# EAGLE design Cyclone_Keychain_SSOP28 (EAGLE 7.7.0)
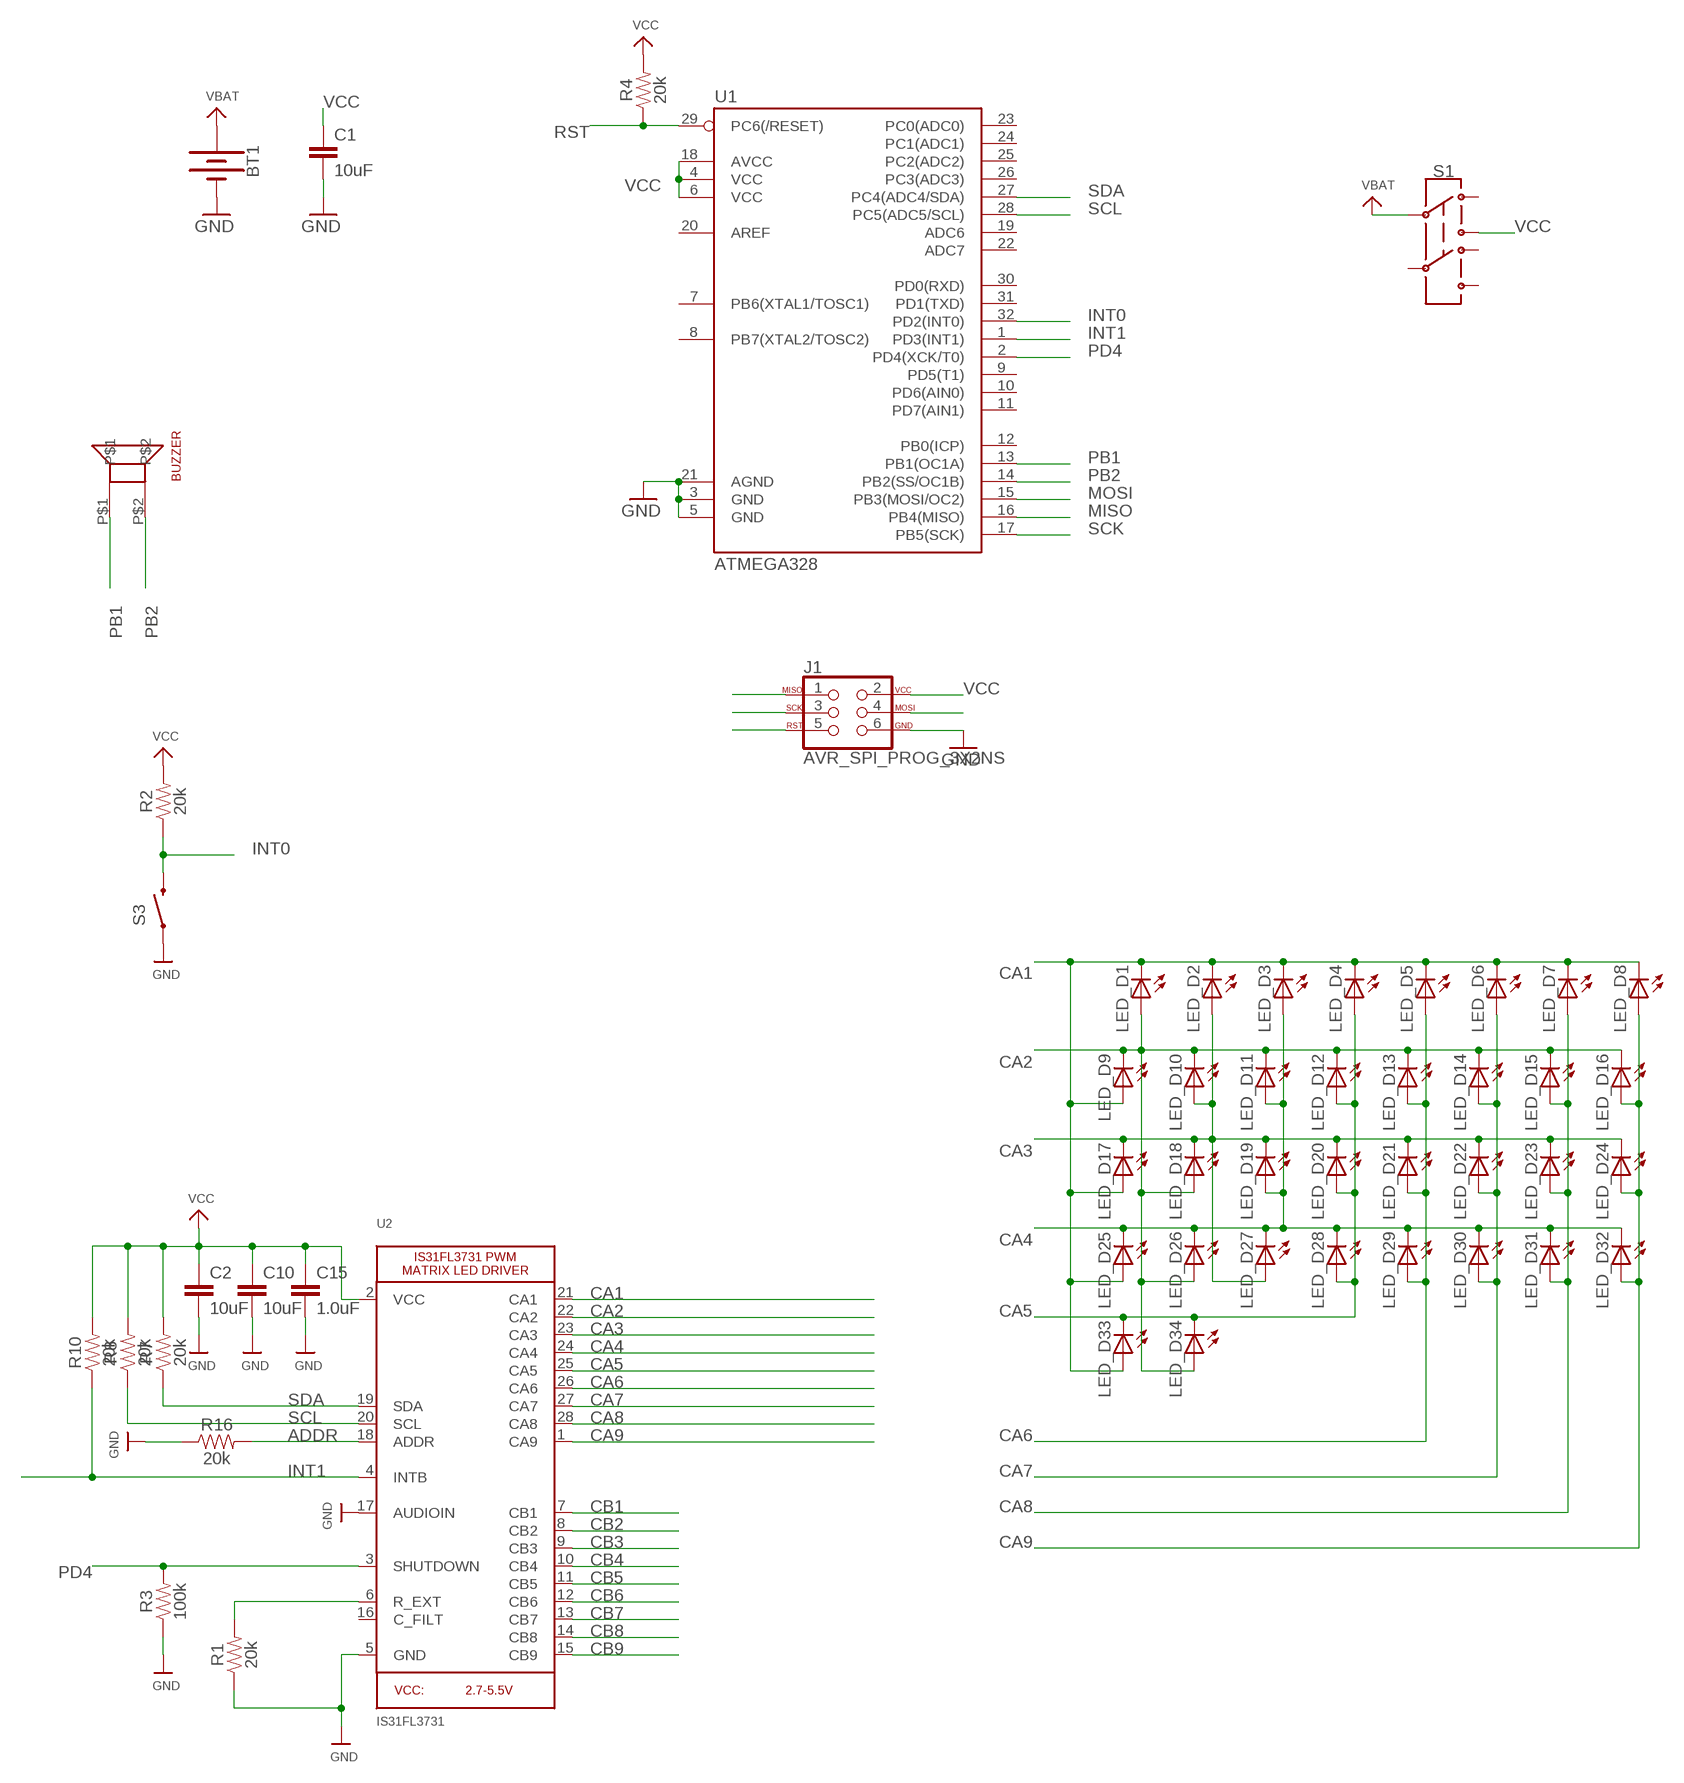
[diagram p0: schematic, sheet 1]

## Parts
BT1  BATTERY-20MM_PTH_WIDEPOS  [BATTCOM_20MM_PTH_WIDEPOS]
C1  10uF  10UF-0805-10V-10%  [0805]
C2  10uF  10UF-0805-10V-10%  [0805]
C10  10uF  10UF-0805-10V-10%  [0805]
C15  1.0uF  1.0UF-0805-25V-10%  [0805]
J1  AVR_SPI_PROG_3X2NS  [2X3-NS]
LED_D1  LEDCHIP-LED0805  [CHIP-LED0805]
LED_D2  LEDCHIP-LED0805  [CHIP-LED0805]
LED_D3  LEDCHIP-LED0805  [CHIP-LED0805]
LED_D4  LEDCHIP-LED0805  [CHIP-LED0805]
LED_D5  LEDCHIP-LED0805  [CHIP-LED0805]
LED_D6  LEDCHIP-LED0805  [CHIP-LED0805]
LED_D7  LEDCHIP-LED0805  [CHIP-LED0805]
LED_D8  LEDCHIP-LED0805  [CHIP-LED0805]
LED_D9  LEDCHIP-LED0805  [CHIP-LED0805]
LED_D10  LEDCHIP-LED0805  [CHIP-LED0805]
LED_D11  LEDCHIP-LED0805  [CHIP-LED0805]
LED_D12  LEDCHIP-LED0805  [CHIP-LED0805]
LED_D13  LEDCHIP-LED0805  [CHIP-LED0805]
LED_D14  LEDCHIP-LED0805  [CHIP-LED0805]
LED_D15  LEDCHIP-LED0805  [CHIP-LED0805]
LED_D16  LEDCHIP-LED0805  [CHIP-LED0805]
LED_D17  LEDCHIP-LED0805  [CHIP-LED0805]
LED_D18  LEDCHIP-LED0805  [CHIP-LED0805]
LED_D19  LEDCHIP-LED0805  [CHIP-LED0805]
LED_D20  LEDCHIP-LED0805  [CHIP-LED0805]
LED_D21  LEDCHIP-LED0805  [CHIP-LED0805]
LED_D22  LEDCHIP-LED0805  [CHIP-LED0805]
LED_D23  LEDCHIP-LED0805  [CHIP-LED0805]
LED_D24  LEDCHIP-LED0805  [CHIP-LED0805]
LED_D25  LEDCHIP-LED0805  [CHIP-LED0805]
LED_D26  LEDCHIP-LED0805  [CHIP-LED0805]
LED_D27  LEDCHIP-LED0805  [CHIP-LED0805]
LED_D28  LEDCHIP-LED0805  [CHIP-LED0805]
LED_D29  LEDCHIP-LED0805  [CHIP-LED0805]
LED_D30  LEDCHIP-LED0805  [CHIP-LED0805]
LED_D31  LEDCHIP-LED0805  [CHIP-LED0805]
LED_D32  LEDCHIP-LED0805  [CHIP-LED0805]
LED_D33  LEDCHIP-LED0805  [CHIP-LED0805]
LED_D34  LEDCHIP-LED0805  [CHIP-LED0805]
R1  20k  20KOHM-0805-1/8W-5%  [0805]
R2  20k  20KOHM-0805-1/8W-5%  [0805]
R3  100k  20KOHM-0805-1/8W-5%  [0805]
R4  20k  20KOHM-0805-1/8W-5%  [0805]
R7  20k  20KOHM-0805-1/8W-5%  [0805]
R8  20k  20KOHM-0805-1/8W-5%  [0805]
R10  20k  20KOHM-0805-1/8W-5%  [0805]
R16  20k  20KOHM-0805-1/8W-5%  [0805]
S1  SWITCH-DPDT-SMD-AYZ0202  [SWITCH_DPDT_SMD_AYZ0202]
S3  SWITCH-MOMENTARY-2SMD  [TACTILE_SWITCH_SMD]
U1  ATMEGA328  ATMEGA328P_TQFP  [TQFP32-08]
U2  IS31FL3731  IS31FL3731SSOP  [SSOP28DB]
U$11  PIEZO_BUZZER_SMT  [PIEZO_BUZZER_SMT]

## Nets
ADDR: R16.2 U2.18(ADDR)
CA1: LED_D1.C LED_D2.C LED_D3.C LED_D4.C LED_D5.C LED_D6.C LED_D7.C LED_D8.C LED_D9.A LED_D17.A LED_D25.A LED_D33.A U2.21(CA1)
CA2: LED_D1.A LED_D9.C LED_D10.C LED_D11.C LED_D12.C LED_D13.C LED_D14.C LED_D15.C LED_D16.C LED_D18.A LED_D26.A LED_D34.A U2.22(CA2)
CA3: LED_D2.A LED_D10.A LED_D17.C LED_D18.C LED_D19.C LED_D20.C LED_D21.C LED_D22.C LED_D23.C LED_D24.C LED_D27.A U2.23(CA3)
CA4: LED_D3.A LED_D11.A LED_D19.A LED_D25.C LED_D26.C LED_D27.C LED_D28.C LED_D29.C LED_D30.C LED_D31.C LED_D32.C U2.24(CA4)
CA5: LED_D4.A LED_D12.A LED_D20.A LED_D28.A LED_D33.C LED_D34.C U2.25(CA5)
CA6: LED_D5.A LED_D13.A LED_D21.A LED_D29.A U2.26(CA6)
CA7: LED_D6.A LED_D14.A LED_D22.A LED_D30.A U2.27(CA7)
CA8: LED_D7.A LED_D15.A LED_D23.A LED_D31.A U2.28(CA8)
CA9: LED_D8.A LED_D16.A LED_D24.A LED_D32.A U2.1(CA9)
CB1: U2.7(CB1)
CB2: U2.8(CB2)
CB3: U2.9(CB3)
CB4: U2.10(CB4)
CB5: U2.11(CB5)
CB6: U2.12(CB6)
CB7: U2.13(CB7)
CB8: U2.14(CB8)
CB9: U2.15(CB9)
GND: BT1.2(-) C1.2 C2.2 C10.2 C15.2 J1.6 R1.1 R3.1 R16.1 S3.1 U1.3(GND) U1.5(GND) U1.21(AGND) U2.5(GND) U2.17(AUDIOIN)
INT0: R2.1 S3.3 U1.32(PD2(INT0))
INT1: R10.1 U1.1(PD3(INT1)) U2.4(INTB)
MISO: J1.1 U1.16(PB4(MISO))
MOSI: J1.4 U1.15(PB3(MOSI/OC2))
PB1: U1.13(PB1(OC1A)) U$11.P$1
PB2: U1.14(PB2(SS/OC1B)) U$11.P$2
PD4: R3.2 U1.2(PD4(XCK/T0)) U2.3(SHUTDOWN)
R_EXT: R1.2 U2.6(R_EXT)
RST: J1.5 R4.1 U1.29(PC6(/RESET))
SCK: J1.3 U1.17(PB5(SCK))
SCL: R8.1 U1.28(PC5(ADC5/SCL)) U2.20(SCL)
SDA: R7.1 U1.27(PC4(ADC4/SDA)) U2.19(SDA)
VBAT: BT1.1(+) S1.2
VCC: C1.1 C2.1 C10.1 C15.1 J1.2 R2.2 R4.2 R7.2 R8.2 R10.2 S1.3 U1.4(VCC) U1.6(VCC) U1.18(AVCC) U2.2(VCC)
Unconnected: S1.1 S1.4 S1.5 S1.6 U1.7(PB6(XTAL1/TOSC1)) U1.8(PB7(XTAL2/TOSC2)) U1.9(PD5(T1)) U1.10(PD6(AIN0)) U1.11(PD7(AIN1)) U1.12(PB0(ICP)) U1.19(ADC6) U1.20(AREF) U1.22(ADC7) U1.23(PC0(ADC0)) U1.24(PC1(ADC1)) U1.25(PC2(ADC2)) U1.26(PC3(ADC3)) U1.30(PD0(RXD)) U1.31(PD1(TXD)) U2.16(C_FILT)

## Library data of the parts
BT1 = SparkFun-Batteries:BATTERY: Battery - Single Cell A variety of battery chemistries, sizes, and footprints. Device List: 20MM_PTH - Coin Cell Battery Holder - 20mm (PTH) <https://www.sparkfun.com/products/783> 12MM_SMD - Coin Cell Battery Holder - 12mm (SMD) <https://www.sparkfun.com/products/10592> 12MM_PTH - Coin Cell Battery Holder - 12mm (PTH) <https://www.sparkfun.com/products/7948> 20MM_SMD - 20mm Coin Cell Battery Holder (SMD) (2 legs) Used on the Big Time Watch Kit <https://www.sparkfun.com/products/11734> 20MM_SMD_4LEGS - Coin Cell Battery Holder - 20mm (SMD) <https://www.sparkfun.com/products/11892> 20MM_SMD_4LEGS_OVERPASTE - Coin Cell Battery Holder - 20mm (SMD) <https://www.sparkfun.com/products/11892> (Over-paste on the legs) 24.5MM_PTH - Coin Cell Battery Holder - 24.5mm (PTH) <https://www.sparkfun.com/products/8863> 9V - 9V Battery Holder - PC Mount Used on the SparkFun SparkPunk Sound Kit <https://www.sparkfun.com/products/11177> and SparkFun SparkPunk Sequencer Kit <https://www.sparkfun.com/products/12707> 18650 - Battery Holder - 18650 (PTH) <https://www.sparkfun.com/products/13113> AA - Battery Holder - 1xAA (PTH) <https://www.sparkfun.com/products/7949> AAA - Battery Holder - 1xAAA (PTH) <https://www.sparkfun.com/products/12718> AA_KIT - Battery Holder - 1xAA (PTH) <https://www.sparkfun.com/products/7949> Special kit package - pads only have exposed copper on one side of the board. AAA_KIT - Battery Holder - 1xAAA (PTH) <https://www.sparkfun.com/products/12718> Special kit package - pads only have exposed copper on one side of the board.
C1 C2 C10 = SparkFun-Capacitors:10UF: 10.0µF ceramic capacitors A capacitor is a passive two-terminal electrical component used to store electrical energy temporarily in an electric field.; PROD_ID: CAP-11330
C15 = SparkFun-Capacitors:1.0UF: 1µF ceramic capacitors A capacitor is a passive two-terminal electrical component used to store electrical energy temporarily in an electric field.; PROD_ID: CAP-08064
J1 = SparkFun-Connectors:AVR_SPI_PROG_3X2: AVR ISP 6 Pin This is the reduced ISP connector for AVR programming. Common on Arduino. This footprint will take up less PCB space and can be used with a 10-pin to 6-pin adapter such as SKU: BOB-08508 **Special note about "TEST_POINT" package. The stop mask is on the top side, so if you want your programming test points to be on the bottom of your board, make sure to place this package on the bottom side of the board. This also ensure that the orientation to program from the bottom side will be correct. SparkFun Products: SparkFun ISP Pogo Adapter <https://www.sparkfun.com/products/11591> - NS Tiny AVR Programmer <https://www.sparkfun.com/products/11801> -PTH
LED_D1-LED_D34 = led:LED: LED OSRAM: - CHIPLED LG R971, LG N971, LY N971, LG Q971, LY Q971, LO R971, LY R971 LH N974, LH R974 LS Q976, LO Q976, LY Q976 LO Q996 - Hyper CHIPLED LW Q18S LB Q993, LB Q99A, LB R99A - SideLED LS A670, LO A670, LY A670, LG A670, LP A670 LB A673, LV A673, LT A673, LW A673 LH A674 LY A675 LS A676, LA A676, LO A676, LY A676, LW A676 LS A679, LY A679, LG A679 - Hyper Micro SIDELED® LS Y876, LA Y876, LO Y876, LY Y876 LT Y87S - SmartLED LW L88C, LW L88S LB L89C, LB L89S, LG L890 LS L89K, LO L89K, LY L89K LS L896, LA L896, LO L896, LY L896 - TOPLED LS T670, LO T670, LY T670, LG T670, LP T670 LSG T670, LSP T670, LSY T670, LOP T670, LYG T670 LG T671, LOG T671, LSG T671 LB T673, LV T673, LT T673, LW T673 LH T674 LS T676, LA T676, LO T676, LY T676, LB T676, LH T676, LSB T676, LW T676 LB T67C, LV T67C, LT T67C, LS T67K, LO T67K, LY T67K, LW E67C LS E67B, LA E67B, LO E67B, LY E67B, LB E67C, LV E67C, LT E67C LW T67C LS T679, LY T679, LG T679 LS T770, LO T770, LY T770, LG T770, LP T770 LB T773, LV T773, LT T773, LW T773 LH T774 LS E675, LA E675, LY E675, LS T675 LS T776, LA T776, LO T776, LY T776, LB T776 LHGB T686 LT T68C, LB T68C - Hyper Mini TOPLED® LB M676 - Mini TOPLED Santana® LG M470 LS M47K, LO M47K, LY M47K Source: http://www.osram.convergy.de LUXEON: - LUMILED® LXK2-PW12-R00, LXK2-PW12-S00, LXK2-PW14-U00, LXK2-PW14-V00 LXK2-PM12-R00, LXK2-PM12-S00, LXK2-PM14-U00 LXK2-PE12-Q00, LXK2-PE12-R00, LXK2-PE12-S00, LXK2-PE14-T00, LXK2-PE14-U00 LXK2-PB12-K00, LXK2-PB12-L00, LXK2-PB12-M00, LXK2-PB14-N00, LXK2-PB14-P00, LXK2-PB14-Q00 LXK2-PR12-L00, LXK2-PR12-M00, LXK2-PR14-Q00, LXK2-PR14-R00 LXK2-PD12-Q00, LXK2-PD12-R00, LXK2-PD12-S00 LXK2-PH12-R00, LXK2-PH12-S00 LXK2-PL12-P00, LXK2-PL12-Q00, LXK2-PL12-R00 Source: www.luxeon.com KINGBRIGHT: KA-3528ASYC Source: www.kingbright.com
R1 R2 R4 R7 R8 R10 R16 = SparkFun-Resistors:20KOHM: 20kΩ resistor A resistor is a passive two-terminal electrical component that implements electrical resistance as a circuit element. Resistors act to reduce current flow, and, at the same time, act to lower voltage levels within circuits. - Wikipedia
R3 = SparkFun-Resistors:20KOHM: 20kΩ resistor A resistor is a passive two-terminal electrical component that implements electrical resistance as a circuit element. Resistors act to reduce current flow, and, at the same time, act to lower voltage levels within circuits. - Wikipedia; VALUE: 20k
S1 = !CustomParts:SWITCH-DPDT: Double-Pole, Double-Throw (DPDT) Switch Double-pole, double-throw switches. Variant Overview PTH-GPI-152-3013 Used on SparkFun Geiger Counter <https://www.sparkfun.com/products/11345> SMD-AY0202 Surface Mount DPDT Switch <https://www.sparkfun.com/products/597> (COM-00597) Used on e.g. LilyPad Arduino USB - ATmega32U4 Board <https://www.sparkfun.com/products/12049>; PROD_ID: SWCH-08179; SF_SKU: COM-00597
S3 = SparkFun:SWITCH-MOMENTARY-2
U1 = SparkFun-IC-Microcontroller:ATMEGA328P_TQFP: Popular 328P in QFP Storefront component: ATmega328 - TQFP <https://www.sparkfun.com/products/13448> (COM-13448) Datasheet <http://www.sparkfun.com/datasheets/Components/SMD/ATMega328.pdf> SparkFun Products SparkFun RedBoard - Programmed with Arduino <https://www.sparkfun.com/products/12757> (DEV-12757) Arduino Pro Mini 328 - 5V/16MHz <https://www.sparkfun.com/products/11113> (DEV-11113) Arduino Pro Mini 328 - 3.3V/8MHz <https://www.sparkfun.com/products/11114> (DEV-11114) SparkFun OpenLog <https://www.sparkfun.com/products/13712> (DEV-13712) SparkFun MicroView - OLED Arduino Module <https://www.sparkfun.com/products/12923> (DEV-12923) SparkFun Digital Sandbox <https://www.sparkfun.com/products/12651> (DEV-12651) SparkFun PicoBoard <https://www.sparkfun.com/products/11888> (WIG-11888) Arduino Fio <https://www.sparkfun.com/products/10116> (DEV-10116) LilyPad Arduino 328 Main Board <https://www.sparkfun.com/products/13342> (DEV-13342) SparkFun RedStick <https://www.sparkfun.com/products/13741> (DEV-13741) LilyPad MP3 <https://www.sparkfun.com/products/11013> (DEV-11013) LilyPad Arduino SimpleSnap <https://www.sparkfun.com/products/10941> (DEV-10941) SparkFun Stepoko <https://www.sparkfun.com/products/13899> (ROB-13899) SparkFun Geiger Counter <https://www.sparkfun.com/products/11345> (SEN-11345) SparkFun EL Sequencer <https://www.sparkfun.com/products/12781> (COM-12781) Arduino Pro 328 - 5V/16MHz <https://www.sparkfun.com/products/10915> (DEV-10915) CryptoCape <https://www.sparkfun.com/products/12773> (DEV-12773) SparkFun IR Thermometer Evaluation Board - MLX90614 <https://www.sparkfun.com/products/10740> (SEN-10740) SparkFun RedBot Mainboard <https://www.sparkfun.com/products/12097> (ROB-12097) Arduino Pro 328 - 3.3V/8MHz <https://www.sparkfun.com/products/10914> (DEV-10914) SparkFun Block for Intel® Edison - Arduino <https://www.sparkfun.com/products/13036> (DEV-13036) SparkFun Simon Says - Surface Mount Soldering Kit <https://www.sparkfun.com/products/10935> (KIT-10935) SparkFun 7-Segment Serial Display - Red <https://www.sparkfun.com/products/11441> (COM-11441) SparkFun 7-Segment Serial Display - White <https://www.sparkfun.com/products/11629> (COM-11629) SparkFun 7-Segment Serial Display - Yellow <https://www.sparkfun.com/products/11443> (COM-11443) SparkFun 7-Segment Serial Display - Kelly Green <https://www.sparkfun.com/products/11440> (COM-11440) SparkFun 7-Segment Serial Display - Blue <https://www.sparkfun.com/products/11442> (COM-11442) SparkFun OpenSegment Serial Display - 20mm (Blue) <https://www.sparkfun.com/products/11647> (COM-11647) SparkFun OpenSegment Serial Display - 20mm (Green) <https://www.sparkfun.com/products/11646> (COM-11646) SparkFun OpenSegment Serial Display - 20mm (White) <https://www.sparkfun.com/products/11648> (COM-11648) SparkFun OpenSegment Serial Display - 20mm (Red) <https://www.sparkfun.com/products/11644> (COM-11644) SparkFun OpenSegment Serial Display - 20mm (Yellow) <https://www.sparkfun.com/products/11645> (COM-11645) SparkFun OpenSegment Shield <https://www.sparkfun.com/products/13190> (DEV-13190); PROD_ID: IC-09069; VALUE: ATMEGA328P_TQFP
U2 = !CustomParts:IS31FL3731: IS31FL3731 PWM LED Matrix Driver
U$11 = !CustomParts:PIEZO_BUZZER_SMT: CUI Inc. CPT-9019S-SMT

## Net classes
2 LEDPower: width 0.203 mm
3 ButtonSignal: width 0.203 mm

## Board
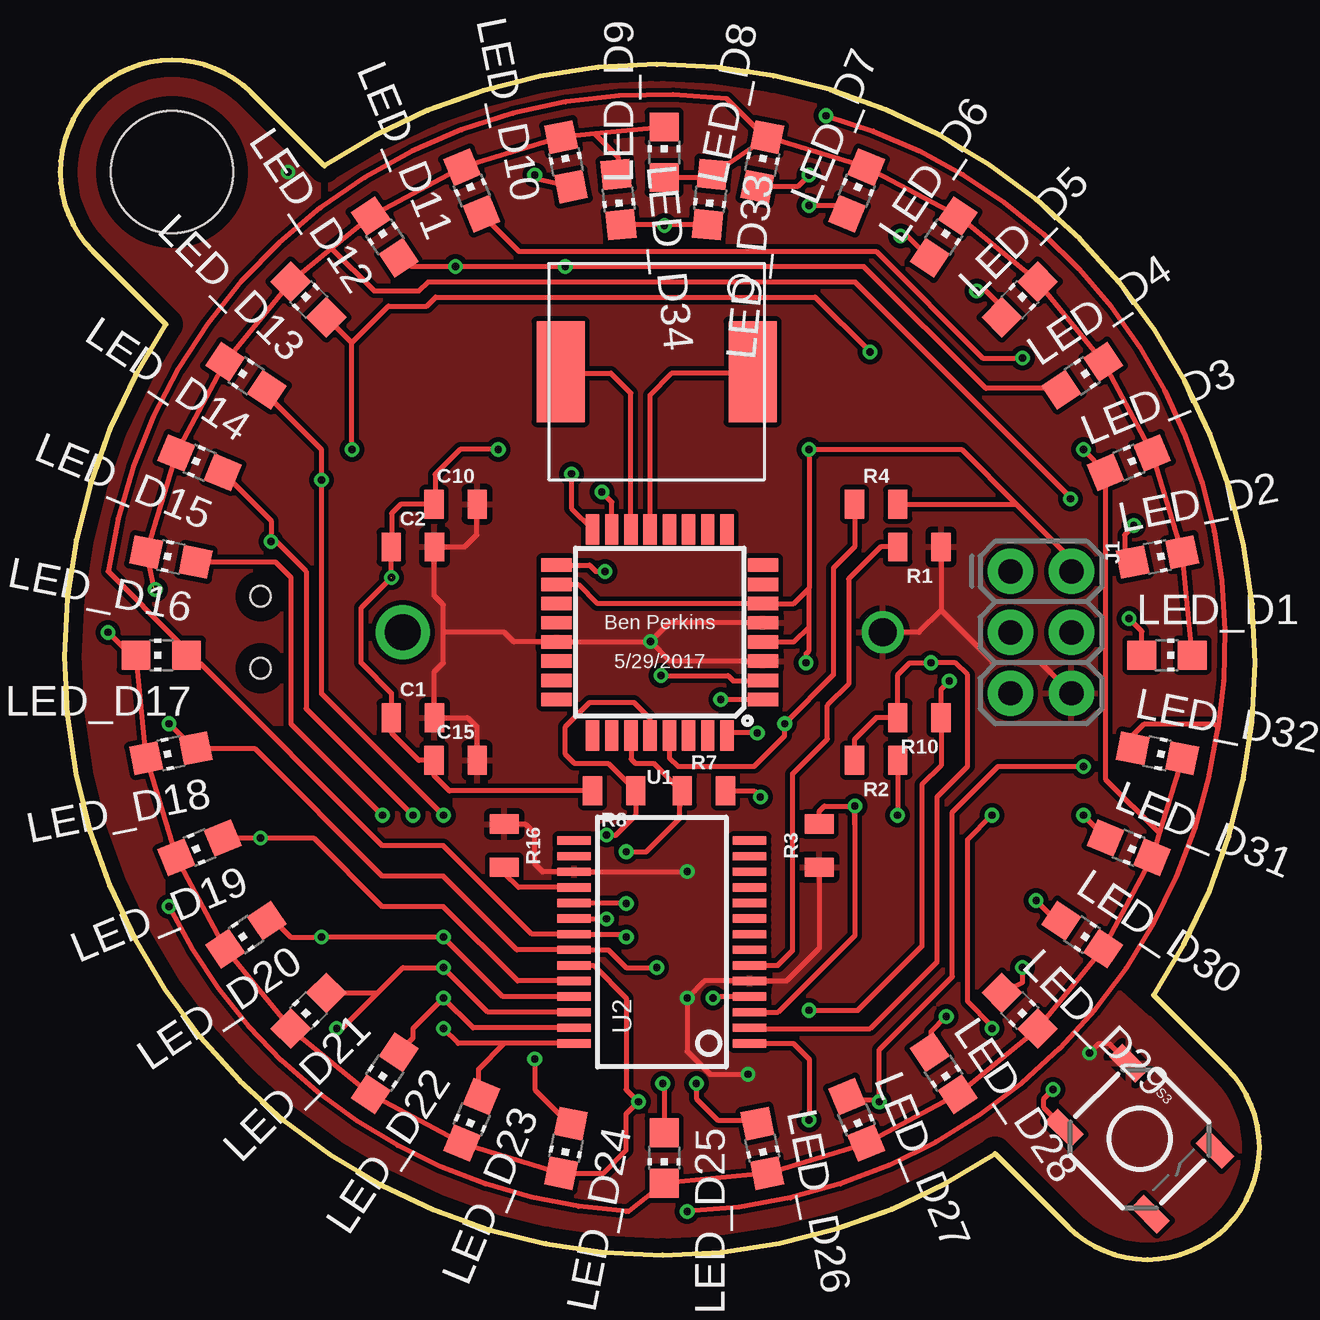
[diagram p1: board, top side]
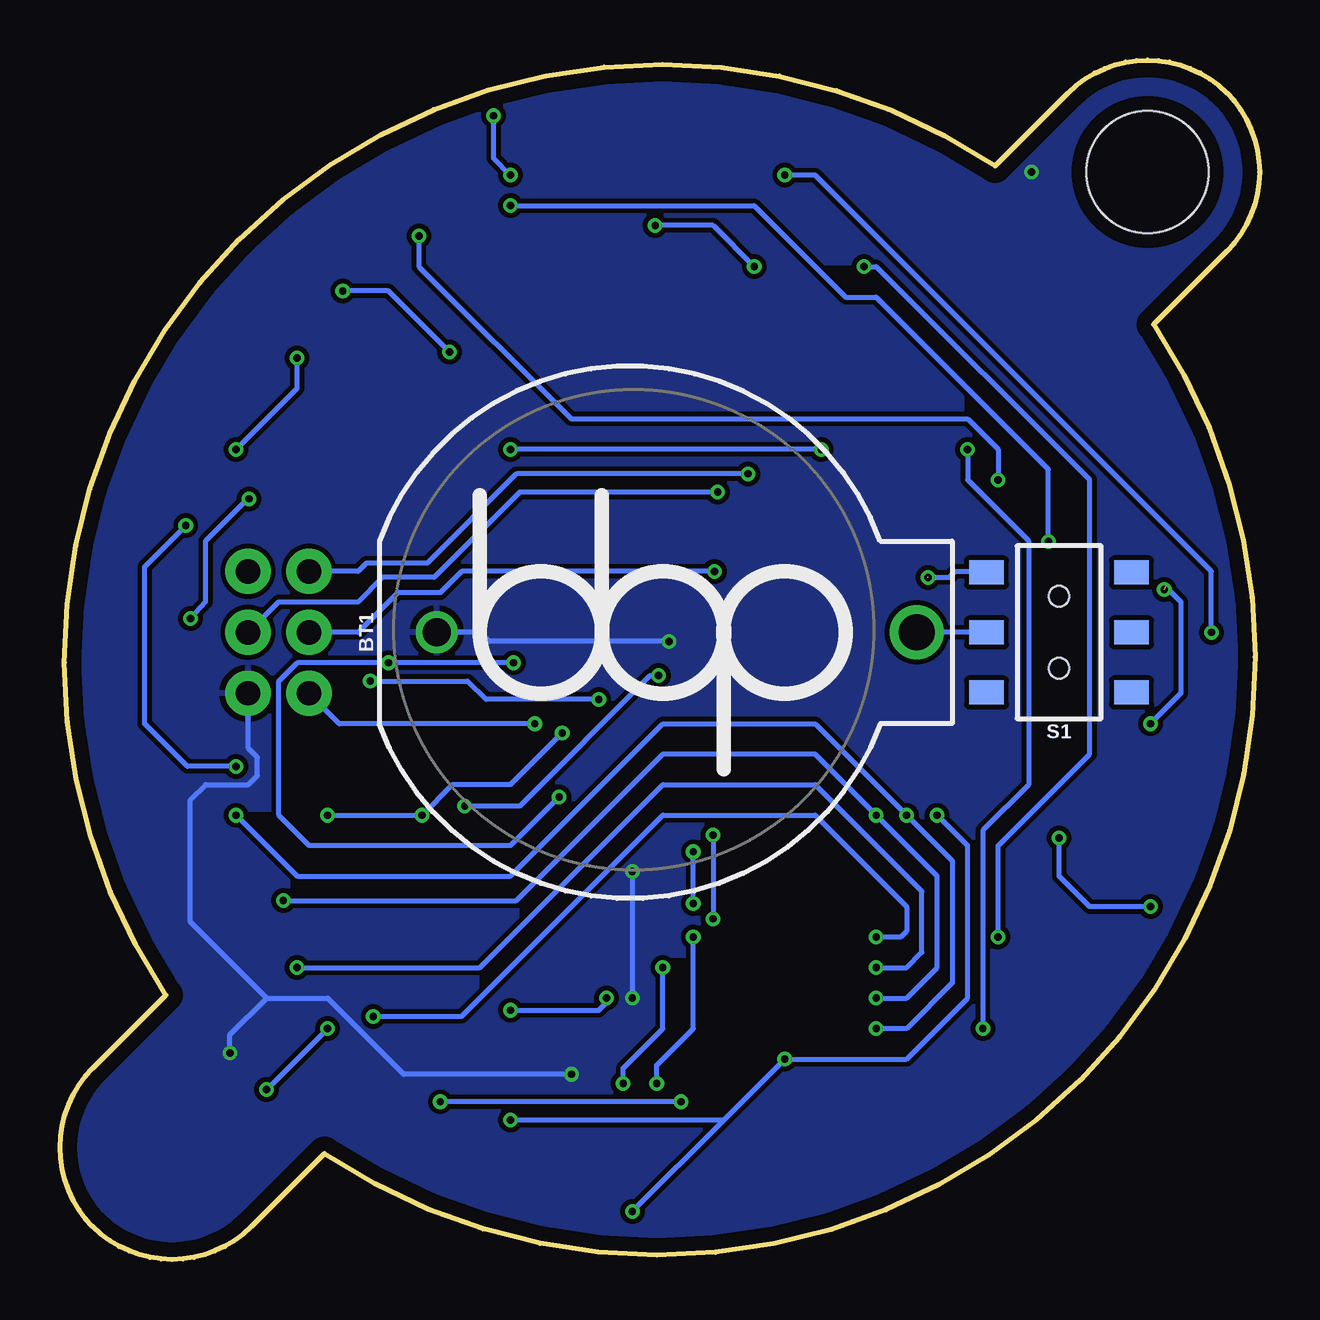
[diagram p2: board, bottom side, seen from below]

Size 49.98 x 49.98 mm. Coordinates in mm from the lower left corner, seen from the top.
Outline: 45.56,11.02 arc158 11.02,45.56 7.97,48.61 arc180 1.37,42.01 4.42,38.96 arc158 38.96,4.42 42.01,1.37 arc180 48.61,7.97 45.56,11.02
Copper layers (1*16): Top 0.035mm / dielectric 1.5mm / Bottom 0.035mm
Design rules "SeeedStudio_2layer_DRU_no_angle_20140221 *": minimum track width 6mil, minimum drill 12mil, track to track 8mil, track to pad 12mil, pad to pad 8mil, via to via 8mil, smd to smd 0mil, copper to edge 24mil, drill to drill 10mil, minimum pad ring 10mil, minimum via ring 6mil, stop-mask expansion 2mil, vias tented up to drill 100mil, thermal gap 10mil
Holes 5.08 mm at 4.67,45.31
tRestrict: area 16.2,18.9 to 16.4,19.1; area 3.8,25.9 to 3.9,26.5; area 4.4,15.2 to 4.9,15.7; area 10.9,44.3 to 11.1,45.2; area 44.3,10.3 to 45.4,11.5; area 8.9,22.1 to 9.4,22.2
bRestrict: area 40,15.2 to 40.4,15.7; area 41.1,18.4 to 42.1,18.6; area 30.7,14.2 to 30.8,14.7; area 32.2,11.4 to 32.5,11.9; area 24,12.2 to 24.5,12.5; area 17,41.3 to 18.1,41.4; area 12.1,35.3 to 12.3,36

### Footprints (pad centres in the part's own frame; a part is rotated, then mirrored left to right if it is on the bottom)
BATTCOM_20MM_PTH_WIDEPOS = drill 1.499: 1 11.85,0 | drill 1.168: 2 -8.15,0
0805 = smd 0.8 x 1.2: 1 -0.9,0; 2 0.9,0
2X3-NS = drill 1.016 pad 1.88: 1 -2.54,-1.27; 2 -2.54,1.27; 3 0,-1.27; 4 0,1.27; 5 2.54,-1.27; 6 2.54,1.27
CHIP-LED0805 = smd 1.2 x 1.2: A 0,-1.05; C 0,1.05
SWITCH_DPDT_SMD_AYZ0202 = smd 1 x 1.45: 1 -2.5,3.02; 2 0,3.02; 3 2.5,3.02; 4 -2.5,-3.02; 5 0,-3.02; 6 2.5,-3.02 | hole 0.85: 1.5,0; -1.5,0
TACTILE_SWITCH_SMD = smd 1.524 x 0.762: 1 -2.54,1.905; 2 2.54,1.905; 3 -2.54,-1.905; 4 2.54,-1.905
TQFP32-08 = smd 1.27 x 0.559: 1 -4.293,2.8; 2 -4.293,2; 3 -4.293,1.2; 4 -4.293,0.4; 5 -4.293,-0.4; 6 -4.293,-1.2; 7 -4.293,-2; 8 -4.293,-2.8; 17 4.293,-2.8; 18 4.293,-2; 19 4.293,-1.2; 20 4.293,-0.4; 21 4.293,0.4; 22 4.293,1.2; 23 4.293,2; 24 4.293,2.8 | smd 0.559 x 1.27: 9 -2.8,-4.293; 10 -2,-4.293; 11 -1.2,-4.293; 12 -0.4,-4.293; 13 0.4,-4.293; 14 1.2,-4.293; 15 2,-4.293; 16 2.8,-4.293; 25 2.8,4.293; 26 2,4.293; 27 1.2,4.293; 28 0.4,4.293; 29 -0.4,4.293; 30 -1.2,4.293; 31 -2,4.293; 32 -2.8,4.293
SSOP28DB = smd 0.348 x 1.397: 1 -4.225,-3.656; 2 -3.575,-3.656; 3 -2.925,-3.656; 4 -2.275,-3.656; 5 -1.625,-3.656; 6 -0.975,-3.656; 7 -0.325,-3.656; 8 0.325,-3.656; 9 0.975,-3.656; 10 1.625,-3.656; 11 2.275,-3.656; 12 2.925,-3.656; 13 3.575,-3.656; 14 4.225,-3.656; 15 4.225,3.656; 16 3.575,3.656; 17 2.925,3.656; 18 2.275,3.656; 19 1.625,3.656; 20 0.975,3.656; 21 0.325,3.656; 22 -0.325,3.656; 23 -0.975,3.656; 24 -1.625,3.656; 25 -2.275,3.656; 26 -2.925,3.656; 27 -3.575,3.656; 28 -4.225,3.656
PIEZO_BUZZER_SMT = smd 4.2 x 2: P$1 0,4; P$2 0,-4

### Placement (x,y rotation side)
BT1  26.13,26.13 0 bottom
C1  14.7,22.58 0 top
C2  14.7,29.69 0 top
C10  16.48,31.47 0 top
C15  16.48,20.8 0 top
J1  40.87,26.13 270 top
LED_D1  46.13,25.18 270 top
LED_D2  45.72,29.27 281.3 top
LED_D3  44.53,33.2 292.5 top
LED_D4  42.6,36.82 303.8 top
LED_D5  39.99,40 315 top
LED_D6  36.81,42.61 326.3 top
LED_D7  33.19,44.54 337.5 top
LED_D8  29.26,45.74 348.8 top
LED_D9  25.17,46.14 0 top
LED_D10  21.08,45.74 11.3 top
LED_D11  17.15,44.54 22.5 top
LED_D12  13.53,42.61 33.8 top
LED_D13  10.36,40 45 top
LED_D14  7.75,36.82 56.3 top
LED_D15  5.81,33.2 67.5 top
LED_D16  4.62,29.27 78.8 top
LED_D17  4.22,25.18 90 top
LED_D18  4.62,21.09 101.3 top
LED_D19  5.81,17.16 112.5 top
LED_D20  7.75,13.54 123.8 top
LED_D21  10.36,10.37 135 top
LED_D22  13.53,7.76 146.3 top
LED_D23  17.15,5.82 157.5 top
LED_D24  21.08,4.63 168.8 top
LED_D25  25.17,4.23 180 top
LED_D26  29.26,4.63 191.3 top
LED_D27  33.19,5.82 202.5 top
LED_D28  36.81,7.76 213.8 top
LED_D29  39.99,10.37 225 top
LED_D30  42.6,13.54 236.3 top
LED_D31  44.53,17.16 247.5 top
LED_D32  45.72,21.09 258.8 top
LED_D33  27.09,44.17 174.4 top
LED_D34  23.28,44.17 185.6 top
R1  35.81,29.69 180 top
R2  34.01,20.8 180 top
R3  31.64,17.24 90 top
R4  34.01,31.47 0 top
R7  26.83,19.53 0 top
R8  23.08,19.53 180 top
R10  35.81,22.58 180 top
R16  18.51,17.24 270 top
S1  8.35,26.13 90 bottom
S3  44.98,5.03 315 top
U1  24.99,26.13 180 top
U2  25.08,13.23 90 top
U$11  24.86,36.99 270 top

### Tracks (layer width: path | path; a pad name or v marks a point on that pad's centre or on a via)
ADDR
  Top 0.203: R16.2 18.51,16.1 19.11,15.5 U2.18
CA1  (via drill 0.3)
  Top 0.203: LED_D1.C LED_D2.C LED_D3.C LED_D4.C LED_D5.C LED_D6.C LED_D7.C LED_D8.C | LED_D8.C 29.41,46.73 27.78,48.36 arc89 2,28.67 4.97,25.71 LED_D17.A 5.59,24.86 5.81,24.86 13.43,17.24 15.97,17.24 19.66,13.55 U2.21 23.47,13.55 v23.59,13.43 | v25.12,7.34 25.17,7.28 LED_D25.A | LED_D9.A 26.96,45.09 LED_D33.A LED_D8.C
  Bottom 0.203: v25.12,7.34 25.12,8.1 23.59,9.62 v23.59,13.43
CA2  (via drill 0.3)  (1 unrouted)
  Top 0.203: LED_D9.C 22.28,46.9 | 22.28,46.9 LED_D10.C LED_D11.C LED_D12.C 11.31,42.13 | v4.54,22.32 5.36,21.51 LED_D18.A 8.1,21.3 13.43,15.97 15.97,15.97 19.04,12.9 U2.22 22.85,12.9 23.59,12.16 v24.86,12.16 | 3.88,28.06 LED_D16.C LED_D15.C LED_D14.C LED_D13.C 11.31,42.13 | v26.51,7.34 26.51,6.7 27.4,5.81 28.67,5.81 LED_D26.A | LED_D1.A 45.08,26.17 v44.55,26.7 | 11.31,42.13 13.09,40.36 14.96,40.36 15.34,40.74 33.12,40.74 42.11,31.75 v42.11,31.7 | LED_D34.A 23.28,45.91 22.28,46.9
  Bottom 0.203: v44.55,26.7 43.91,27.4 43.91,29.94 42.16,31.7 v42.11,31.7 | v26.51,7.34 26.51,7.97 24.86,9.62 v24.86,12.16 | v3.97,27.91 3.78,27.91 3.27,27.4 3.27,23.59 v4.54,22.32
CA3  (via drill 0.3)
  Top 0.203: v42.64,20.54 39.09,20.54 37.18,18.64 37.18,11.78 34.13,8.73 v34.13,6.57 34.05,6.66 32.9,6.66 LED_D27.A | v2,26.13 3.27,24.86 3.27,24.99 LED_D17.C LED_D18.C LED_D19.C LED_D20.C LED_D21.C LED_D22.C LED_D23.C LED_D24.C 22.65,3.6 23.59,4.54 23.59,6.07 v24.1,6.57 23.59,7.08 23.59,10.89 22.23,12.25 U2.23 | LED_D10.A 19.97,45 v19.78,45.18 | 32.85,6.57 LED_D27.A | 32.63,6.96 LED_D27.A | v44.74,30.58 44.36,30.2 44.36,29.5 44.7,29.16 LED_D2.A
  Bottom 0.203: v2,26.13 2,28.67 18.51,45.18 v19.78,45.18 | v24.1,6.57 v34.13,6.57 | v44.74,30.58 46.45,28.86 46.45,22.32 44.67,20.54 v42.64,20.54
CA4  (via drill 0.3)
  Top 0.203: v4.54,14.7 arc60 23.59,2 23.7,2 LED_D25.C LED_D26.C LED_D27.C LED_D28.C LED_D29.C LED_D30.C LED_D31.C 45.81,17.77 | v40.1,37.56 38.45,37.56 34.01,42.01 19.12,42.01 LED_D11.A | v42.64,33.75 43.56,32.83 LED_D3.A 43.56,20.02 45.81,17.77 | LED_D19.A v8.35,17.57 | v8.35,17.57 v8.35,17.56 | v8.35,17.57 10.57,17.57 13.43,14.7 15.97,14.7 19.07,11.6 U2.24 | LED_D32.C 45.81,17.77
  Bottom 0.203: v4.54,14.7 7.08,14.7 8.35,15.97 v8.35,17.56 v8.35,17.57 | v42.64,33.75 40.1,36.29 v40.1,37.56
CA5  (via drill 0.3)
  Top 0.203: LED_D4.A 41.86,36.29 38.58,36.29 33.5,41.37 v21.05,41.37 v16.48,41.37 14.65,41.37 14.04,41.98 LED_D12.A 13.95,41.62 | LED_D20.A 9.1,13.96 9.62,13.43 v10.89,13.43 v15.97,13.43 18.45,10.95 U2.25 | LED_D28.A 36.29,8.49 36.29,9.5 v36.93,10.13 | LED_D33.C 25.28,43.12 v25.18,43.09 25.15,43.12 LED_D34.C
  Bottom 0.203: v10.89,13.43 10.89,17.24 7.08,21.05 7.08,32.48 15.97,41.37 v16.48,41.37 | v36.93,10.13 33.24,10.13 24.86,18.51 18.51,18.51 14.7,14.7 14.7,13.69 14.96,13.43 v15.97,13.43 | v21.05,41.37 22.77,43.09 v25.18,43.09
CA6  (via drill 0.3)
  Top 0.203: LED_D5.A 39.46,39.46 38.56,40.36 v38.2,40.36 | 10.89,10.9 LED_D21.A 13.22,11.11 13.22,11.1 | v12.16,33.75 12.16,38.19 | 12.16,38.19 LED_D13.A | 12.16,38.19 12.16,38.2 13.69,39.72 15.27,39.72 15.65,40.1 31.47,40.1 v33.75,37.82 | v40.1,12.16 40.1,11.54 LED_D29.A | U2.26 17.83,10.3 v15.97,12.16 14.28,12.16 13.22,11.1 | v11.53,9.62 11.74,9.62 13.22,11.1
  Bottom 0.203: v40.1,12.16 32.48,12.16 24.86,19.78 18.51,19.78 14.07,15.34 14.07,12.8 14.7,12.16 v15.97,12.16 | v38.2,40.36 36.29,40.36 v33.75,37.82 | v11.53,9.62 11.53,17.88 9.62,19.78 9.62,29.94 12.16,32.48 v12.16,33.75
CA7  (via drill 0.3)
  Top 0.203: LED_D30.A 41.97,13.98 41.65,13.98 v40.67,14.96 | v35.02,42.64 35.32,42.64 LED_D6.A | U2.27 17.21,9.65 v15.97,10.89 14.7,9.62 14.7,9.22 LED_D22.A | v15.97,18.51 10.89,23.59 v10.89,32.48 10.89,33.75 8.62,36.02 LED_D14.A
  Bottom 0.203: v40.67,14.96 30.96,14.96 24.86,21.05 18.51,21.05 v15.97,18.51 13.43,15.97 13.43,12.16 14.7,10.89 v15.97,10.89 | v35.02,42.64 35.02,41.37 28.67,35.02 12.16,35.02 10.89,33.75 v10.89,32.48
CA8  (via drill 0.3)
  Top 0.203: 6.65,32.91 LED_D15.A 8.8,30.79 v8.8,29.92 | LED_D31.A 43.7,17.45 v42.64,18.51 | LED_D23.A 17.44,7.28 17.44,7.93 18.51,9 | LED_D7.A 32.45,43.91 v31.21,43.91 | U2.28 18.51,9 | 18.51,9 16.59,9 v15.97,9.62 | v14.7,18.51 10.26,22.96 10.26,28.67 9.01,29.92 v8.8,29.92 | v8.8,29.92 8.8,30.13
  Bottom 0.203: v31.21,43.91 21.05,43.91 17.24,40.1 15.97,40.1 8.8,32.93 v8.8,29.92 | v42.64,18.51 40.1,15.97 31.21,15.97 24.86,22.32 18.51,22.32 v14.7,18.51 12.8,16.61 12.8,11.53 14.7,9.62 v15.97,9.62
CA9  (via drill 0.3)
  Top 0.203: 29.11,44.74 LED_D8.A 30.73,44.7 v31.21,45.18 | v31.91,47.66 arc-84 48.23,22.07 48.23,22.2 | v13.43,18.51 9.62,22.32 9.62,28.42 8.97,29.07 LED_D16.A | 48.23,22.2 arc-80 v26.13,2 | v19.78,8.35 19.78,7.08 21.05,5.81 21.05,5.54 LED_D24.A | LED_D32.A 44.69,21.83 45.18,22.32 48.1,22.32 48.23,22.2 | U2.1 30.56,9 31.21,8.35 v31.21,5.81
  Bottom 0.203: 22.32,5.81 v19.78,8.35 14.7,8.35 12.16,10.89 12.16,17.24 v13.43,18.51 | 22.32,5.81 v31.21,5.81 | v26.13,2 22.32,5.81 | v31.21,45.18 31.91,45.88 v31.91,47.66
GND  (via drill 0.3)
  Top 0.203: v24.61,25.75 24.57,25.84 | C2.2 15.62,29.62 15.59,29.62 | 15.97,26.13 15.97,24.86 15.6,24.49 C1.2 16.99,22.58 17.38,22.18 C15.2 | 15.97,26.13 15.97,27.28 15.59,27.66 15.59,29.68 C2.2 | 15.97,26.13 18.51,26.13 18.91,25.73 U1.21 24.46,25.73 v24.61,25.75 | U1.5 25.39,26.53 v24.61,25.75 | U1.3 25.43,24.93 v24.61,25.75 | BT1.2 35.78,26.13 36.71,27.06 | C2.2 16.86,29.69 17.37,30.2 17.37,31.46 C10.2 | v28.67,7.72 27.08,7.72 26.13,8.67 v26.13,10.89 26.84,11.6 U2.5 30.27,11.6 31.64,12.97 R3.1 | v26.13,16.16 25.04,16.15 U2.17 20.11,16.15 19.78,16.48 19.78,17.75 19.4,18.13 18.52,18.13 R16.1 | R1.1 36.71,27.06 | 36.71,27.06 38.91,24.86 | S3.1 43.72,8.99 43.28,8.99 v42.9,8.61 | J1.6 40.87,24.86 38.83,24.86
  Bottom 0.203: v24.61,25.75 32.1,25.75 32.48,26.13 BT1.2 | 41.37,10.89 38.83,10.89 35.66,7.72 v28.67,7.72 | v26.13,16.16 v26.13,10.89 | J1.6 42.13,21.31 41.75,20.93 41.75,20.16 42.13,19.78 43.91,19.78 44.55,19.15 44.55,14.07 41.37,10.89 | v42.9,8.61 42.9,9.37 41.37,10.89
  other vias: 9.5,45.31
  pour Top: -0.48,-0.47 50.06,-0.47 50.06,50.07 -0.48,50.07
  pour Bottom: -1.75,-0.47 51.33,-0.47 51.33,50.07 -1.75,50.07
INT0  (via drill 0.3)
  Top 0.203: v29.05,21.94 v29.04,21.95 27.9,21.95 U1.32 | v38.83,9.62 38.83,9.75 37.82,10.77 37.82,17.5 v38.83,18.51 | R2.1 34.91,18.63 v34.9,18.51 | S3.3 40.99,6.33 40.99,6.7 v41.37,7.08
  Bottom 0.203: v38.83,18.51 v34.9,18.51 33.63,19.78 31.21,19.78 v29.05,21.94 | v38.83,9.62 v41.37,7.08
INT1  (via drill 0.3)
  Top 0.203: v31.21,10.38 33.24,10.38 35.91,13.05 35.91,19.78 36.71,20.58 R10.1 36.71,23.76 v37.05,24.1 | U2.4 27.27,10.95 v27.21,10.89 | U1.1 v27.54,23.33 v27.53,23.34
  Bottom 0.203: v31.21,10.38 27.53,10.38 27.21,10.7 v27.21,10.89 | v27.53,23.34 32.23,23.34 32.99,24.1 v37.05,24.1
MISO  (via drill 0.3)
  Top 0.203: v21.31,32.74 21.31,31.31 U1.16
  Bottom 0.203: v21.31,32.74 30.96,32.74 34.68,29.02 37.22,29.02 37.56,28.67 J1.1
MOSI  (via drill 0.3)
  Top 0.203: U1.15 22.99,31.56 v22.58,31.97
  Bottom 0.203: v22.58,31.97 30.83,31.97 34.39,28.42 36.55,28.42 37.56,27.4 40.87,27.4 J1.4
PB1
  Top 0.203: 28.77,36.29 U$11.P$1 28.8,36.93 25.5,36.93 24.59,36.02 U1.13
PB2
  Top 0.203: 21.05,36.32 U$11.P$2 | 21.08,36.29 U$11.P$2 | U1.14 23.79,36.1 22.96,36.93 20.93,36.93 U$11.P$2
PD4  (via drill 0.3)
  Top 0.203: U1.2 29.25,24.1 28.06,24.1 27.83,24.33 v25.04,24.33 | U2.3 29.93,10.3 33.12,13.5 v33.12,18.89 | 33.11,18.14 v33.12,18.89 | R3.2 31.64,18.69 31.85,18.89 v33.12,18.89
  Bottom 0.203: v33.12,18.89 30.83,18.89 25.4,24.33 v25.04,24.33
R_EXT
  Top 0.203: R1.2 34.2,29.69 32.86,28.35 32.86,23.97 31.97,23.08 31.97,21.69 30.51,20.23 30.51,12.86 29.91,12.25 U2.6
RST  (via drill 0.3)
  Top 0.203: 25.37,21.93 U1.29 25.39,20.9 25.75,20.54 28.93,20.54 30.2,21.81 v30.2,22.32 32.23,24.35 32.23,28.81 33.11,29.69 R4.1
  Bottom 0.203: v30.2,22.32 38.33,22.32 J1.5
SCK  (via drill 0.3)
  Top 0.203: U1.17 22.06,28.93 22.32,28.67 v22.7,28.67
  Bottom 0.203: v22.7,28.67 33.24,28.67 34.13,27.78 35.91,27.78 37.56,26.13 J1.3
SCL  (via drill 0.3)
  Top 0.203: U1.28 24.59,22.53 23.91,23.21 22.07,23.21 21.05,22.2 21.05,21.05 21.43,20.67 22.84,20.67 R8.1 23.98,18.51 23.16,17.69 v22.77,17.69 | U2.20 22.76,14.2 v22.77,14.19
  Bottom 0.203: v22.77,17.69 v22.77,14.19
SDA  (via drill 0.3)
  Top 0.203: U1.27 23.79,20.85 23.97,20.67 24.74,20.67 25.93,19.48 | U2.19 23.57,14.85 v23.59,14.83 | 25.93,19.48 25.83,19.48 25.83,18.9 25.81,18.89 25.81,18.39 24.42,16.99 v23.59,16.99 | 25.93,19.48 R7.1
  Bottom 0.203: v23.59,14.83 v23.59,16.99
VBAT
  Bottom 0.203: S1.2 BT1.1
VCC  (via drill 0.3)  (1 unrouted)
  Top 0.203: J1.2 42.14,29.17 39.85,31.47 | 13.85,29.52 C2.1 | v18.26,33.75 16.67,33.75 15.63,32.71 15.63,31.52 C10.1 14.19,31.47 13.81,31.09 C2.1 | 31.21,27.97 v31.21,33.75 37.56,33.75 39.85,31.47 | 29.05,19.15 v29.18,19.27 28.93,19.53 R7.2 | 34.77,22.66 R10.2 | 34.64,22.59 R10.2 | R2.2 33.11,21.68 34.01,22.58 R10.2 | C2.1 13.8,28.41 12.54,27.15 12.54,24.86 13.8,23.6 C1.1 13.8,21.95 14.96,20.8 C15.1 15.58,20.17 16.23,19.53 R8.2 | U1.4 30.57,25.73 31.21,26.37 | 31.21,26.37 31.21,27.97 | 31.21,27.97 30.57,27.33 U1.6 22.39,27.33 21.59,28.13 U1.18 | U2.2 28.76,9.62 33.75,9.62 36.55,12.42 36.55,19.27 37.82,20.54 37.82,24.35 37.31,24.86 v36.29,24.86 35.4,24.86 34.91,24.37 R10.2 | 34.9,22.59 R10.2 | R4.2 39.85,31.47 | v31.09,24.86 31.09,25.24 31.21,25.37 31.21,26.37
  Bottom 0.203: v18.26,33.75 v31.21,33.75 | v29.18,19.27 31.21,17.24 39.59,17.24 40.86,18.51 40.86,24.1 40.1,24.86 v36.29,24.86 v31.09,24.86 | v13.81,28.42 12.92,28.42 12.67,28.67 11.41,28.67 S1.3

### Text on the board
tPlace: Ben Perkins | 5/29/2017